# Altium schematic sheet SpannungssensorTP.SchDoc
size A4; SheetNumber: 5; SheetTotal: 7
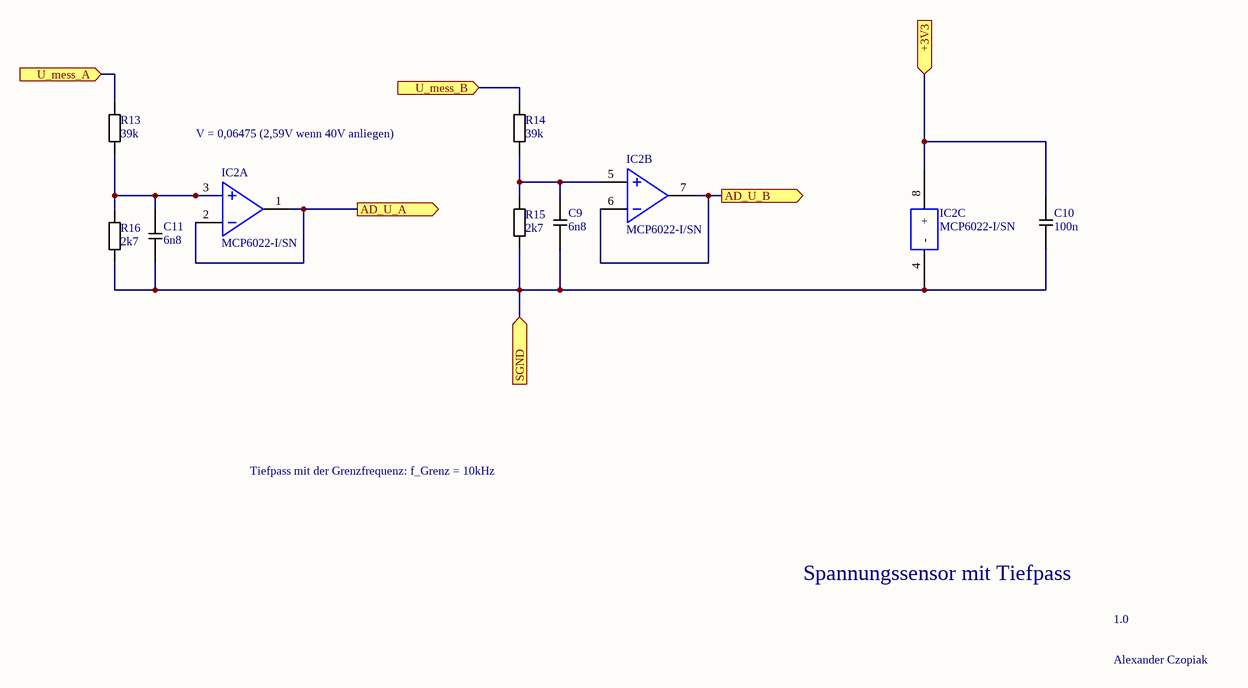
[diagram p0: SpannungssensorTP.SchDoc]

## Parts
C9  6n8  [1206_C]
C10  100n  [1206_C]
C11  6n8  [1206_C]
IC2  MCP6022-I/SN  [SO08_N]  (parts A,B,C of 3)
R13  39k  [1206_R]
R14  39k  [1206_R]
R15  2k7  [1206_R]
R16  2k7  [1206_R]

## Ports
+3V3 (in, see PERSEUS[2C], Gatetreiber[1B], Halbbruecke[2B], Hochsetzsteller[2A], StromsensorTP[3B]), AD_U_A (out, see PERSEUS[2C]), AD_U_B (out, see PERSEUS[2C]), SGND (in, see PERSEUS[2C], Gatetreiber[1D], Halbbruecke[2D], Hochsetzsteller[3D], StromsensorTP[3C]), U_mess_A (in, see PERSEUS[2C]), U_mess_B (in, see PERSEUS[2C])

## Nets
+3V3: C10.2 IC2.8(+) ; port +3V3
AD_U_A: IC2.1 IC2.2 ; port AD_U_A
AD_U_B: IC2.6 IC2.7 ; port AD_U_B
SGND: C9.1 C10.1 C11.1 IC2.4(-) R15.1 R16.1 ; port SGND
U_mess_A: R13.2 ; port U_mess_A
U_mess_B: R14.2 ; port U_mess_B
NetC9_2: C9.2 IC2.5 R14.1 R15.2
NetC11_2: C11.2 IC2.3 R13.1 R16.2

## Notes on the sheet
- V = 0,06475 (2,59V wenn 40V anliegen)
- Tiefpass mit der Grenzfrequenz: f_Grenz = 10kHz
- Spannungssensor mit Tiefpass
- 1.0
- Alexander Czopiak

## Library data of the parts
C9-C11 = CAP: Kondensator (ohne Polarität)
R13-R16 = WIDERSTAND